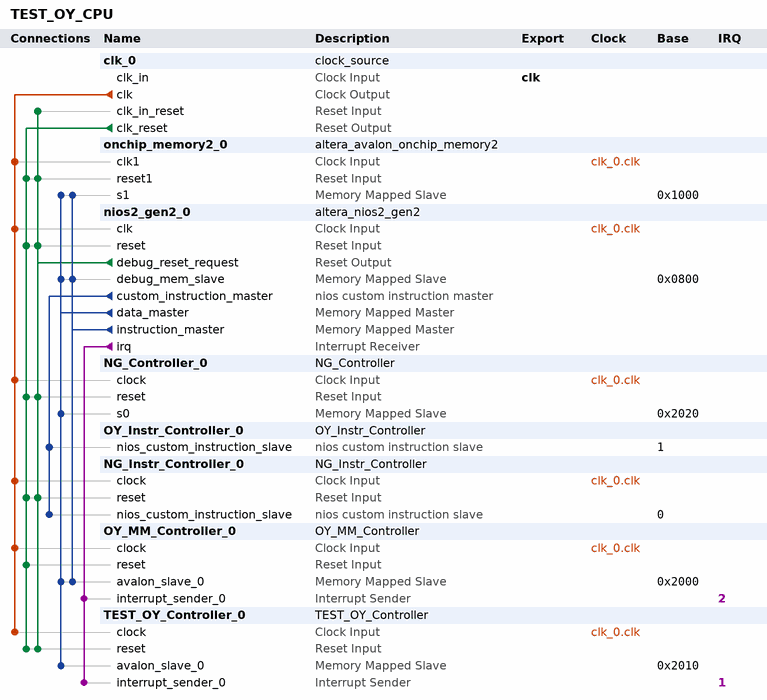
[diagram p0: system contents]
# Platform Designer (Qsys) system TEST_OY_CPU, Cyclone IV E EP4CE115F29C7
# Parameters at their usual value, and those the tool derives, are not listed.
package require -exact qsys 23.1
create_system TEST_OY_CPU
set_project_property DEVICE_FAMILY {Cyclone IV E}
set_project_property DEVICE EP4CE115F29C7

add_instance clk_0 clock_source 23.1
set_instance_parameter_value clk_0 clockFrequency 50000000

add_instance onchip_memory2_0 altera_avalon_onchip_memory2 23.1
set_instance_parameter_value onchip_memory2_0 dataWidth 32
set_instance_parameter_value onchip_memory2_0 dualPort false
set_instance_parameter_value onchip_memory2_0 initMemContent true
set_instance_parameter_value onchip_memory2_0 initializationFileName onchip_mem.hex
set_instance_parameter_value onchip_memory2_0 memorySize 4096

add_instance nios2_gen2_0 altera_nios2_gen2 23.1
set_instance_parameter_value nios2_gen2_0 dcache_size 2048
set_instance_parameter_value nios2_gen2_0 exceptionSlave onchip_memory2_0.s1
set_instance_parameter_value nios2_gen2_0 icache_size 4096
set_instance_parameter_value nios2_gen2_0 impl Tiny
set_instance_parameter_value nios2_gen2_0 resetSlave onchip_memory2_0.s1

add_instance NG_Controller_0 NG_Controller 1.0

add_instance OY_Instr_Controller_0 OY_Instr_Controller 1.0
set_instance_parameter_value OY_Instr_Controller_0 n 16

add_instance NG_Instr_Controller_0 NG_Instr_Controller 1.0

add_instance OY_MM_Controller_0 OY_MM_Controller 1.0
set_instance_parameter_value OY_MM_Controller_0 n 16

add_instance TEST_OY_Controller_0 TEST_OY_Controller 1.0
set_instance_parameter_value TEST_OY_Controller_0 n 16

# connections
add_connection clk_0.clk NG_Controller_0.clock clock
add_connection clk_0.clk NG_Instr_Controller_0.clock clock
add_connection clk_0.clk nios2_gen2_0.clk clock
add_connection clk_0.clk onchip_memory2_0.clk1 clock
add_connection clk_0.clk OY_MM_Controller_0.clock clock
add_connection clk_0.clk TEST_OY_Controller_0.clock clock
add_connection clk_0.clk_reset NG_Controller_0.reset reset
add_connection clk_0.clk_reset NG_Instr_Controller_0.reset reset
add_connection clk_0.clk_reset nios2_gen2_0.reset reset
add_connection clk_0.clk_reset onchip_memory2_0.reset1 reset
add_connection clk_0.clk_reset OY_MM_Controller_0.reset reset
add_connection clk_0.clk_reset TEST_OY_Controller_0.reset reset
add_connection nios2_gen2_0.debug_reset_request clk_0.clk_in_reset reset
add_connection nios2_gen2_0.debug_reset_request NG_Controller_0.reset reset
add_connection nios2_gen2_0.debug_reset_request NG_Instr_Controller_0.reset reset
add_connection nios2_gen2_0.debug_reset_request nios2_gen2_0.reset reset
add_connection nios2_gen2_0.debug_reset_request onchip_memory2_0.reset1 reset
add_connection nios2_gen2_0.debug_reset_request TEST_OY_Controller_0.reset reset
add_connection nios2_gen2_0.data_master NG_Controller_0.s0 avalon
set_connection_parameter_value nios2_gen2_0.data_master/NG_Controller_0.s0 baseAddress 0x2020
add_connection nios2_gen2_0.data_master nios2_gen2_0.debug_mem_slave avalon
set_connection_parameter_value nios2_gen2_0.data_master/nios2_gen2_0.debug_mem_slave baseAddress 0x0800
add_connection nios2_gen2_0.data_master onchip_memory2_0.s1 avalon
set_connection_parameter_value nios2_gen2_0.data_master/onchip_memory2_0.s1 baseAddress 0x1000
add_connection nios2_gen2_0.data_master OY_MM_Controller_0.avalon_slave_0 avalon
set_connection_parameter_value nios2_gen2_0.data_master/OY_MM_Controller_0.avalon_slave_0 baseAddress 0x2000
add_connection nios2_gen2_0.data_master TEST_OY_Controller_0.avalon_slave_0 avalon
set_connection_parameter_value nios2_gen2_0.data_master/TEST_OY_Controller_0.avalon_slave_0 baseAddress 0x2010
add_connection nios2_gen2_0.instruction_master nios2_gen2_0.debug_mem_slave avalon
set_connection_parameter_value nios2_gen2_0.instruction_master/nios2_gen2_0.debug_mem_slave baseAddress 0x0800
add_connection nios2_gen2_0.instruction_master onchip_memory2_0.s1 avalon
set_connection_parameter_value nios2_gen2_0.instruction_master/onchip_memory2_0.s1 baseAddress 0x1000
add_connection nios2_gen2_0.instruction_master OY_MM_Controller_0.avalon_slave_0 avalon
set_connection_parameter_value nios2_gen2_0.instruction_master/OY_MM_Controller_0.avalon_slave_0 baseAddress 0x2000
add_connection nios2_gen2_0.irq OY_MM_Controller_0.interrupt_sender_0 interrupt
set_connection_parameter_value nios2_gen2_0.irq/OY_MM_Controller_0.interrupt_sender_0 irqNumber 2
add_connection nios2_gen2_0.irq TEST_OY_Controller_0.interrupt_sender_0 interrupt
set_connection_parameter_value nios2_gen2_0.irq/TEST_OY_Controller_0.interrupt_sender_0 irqNumber 1
add_connection nios2_gen2_0.custom_instruction_master NG_Instr_Controller_0.nios_custom_instruction_slave nios_custom_instruction
set_connection_parameter_value nios2_gen2_0.custom_instruction_master/NG_Instr_Controller_0.nios_custom_instruction_slave CIName ng_instr_controller_0
set_connection_parameter_value nios2_gen2_0.custom_instruction_master/NG_Instr_Controller_0.nios_custom_instruction_slave baseAddress 0
add_connection nios2_gen2_0.custom_instruction_master OY_Instr_Controller_0.nios_custom_instruction_slave nios_custom_instruction
set_connection_parameter_value nios2_gen2_0.custom_instruction_master/OY_Instr_Controller_0.nios_custom_instruction_slave CIName oy_instr_controller_0
set_connection_parameter_value nios2_gen2_0.custom_instruction_master/OY_Instr_Controller_0.nios_custom_instruction_slave baseAddress 1

# exported interfaces
add_interface clk clock sink
set_interface_property clk EXPORT_OF clk_0.clk_in

set_interconnect_requirement {$system} qsys_mm.clockCrossingAdapter HANDSHAKE
set_interconnect_requirement {$system} qsys_mm.enableEccProtection FALSE
set_interconnect_requirement {$system} qsys_mm.insertDefaultSlave FALSE
set_interconnect_requirement {$system} qsys_mm.maxAdditionalLatency 1

save_system TEST_OY_CPU.qsys
